# EAGLE schematic design4B (EAGLE 7.6.0)
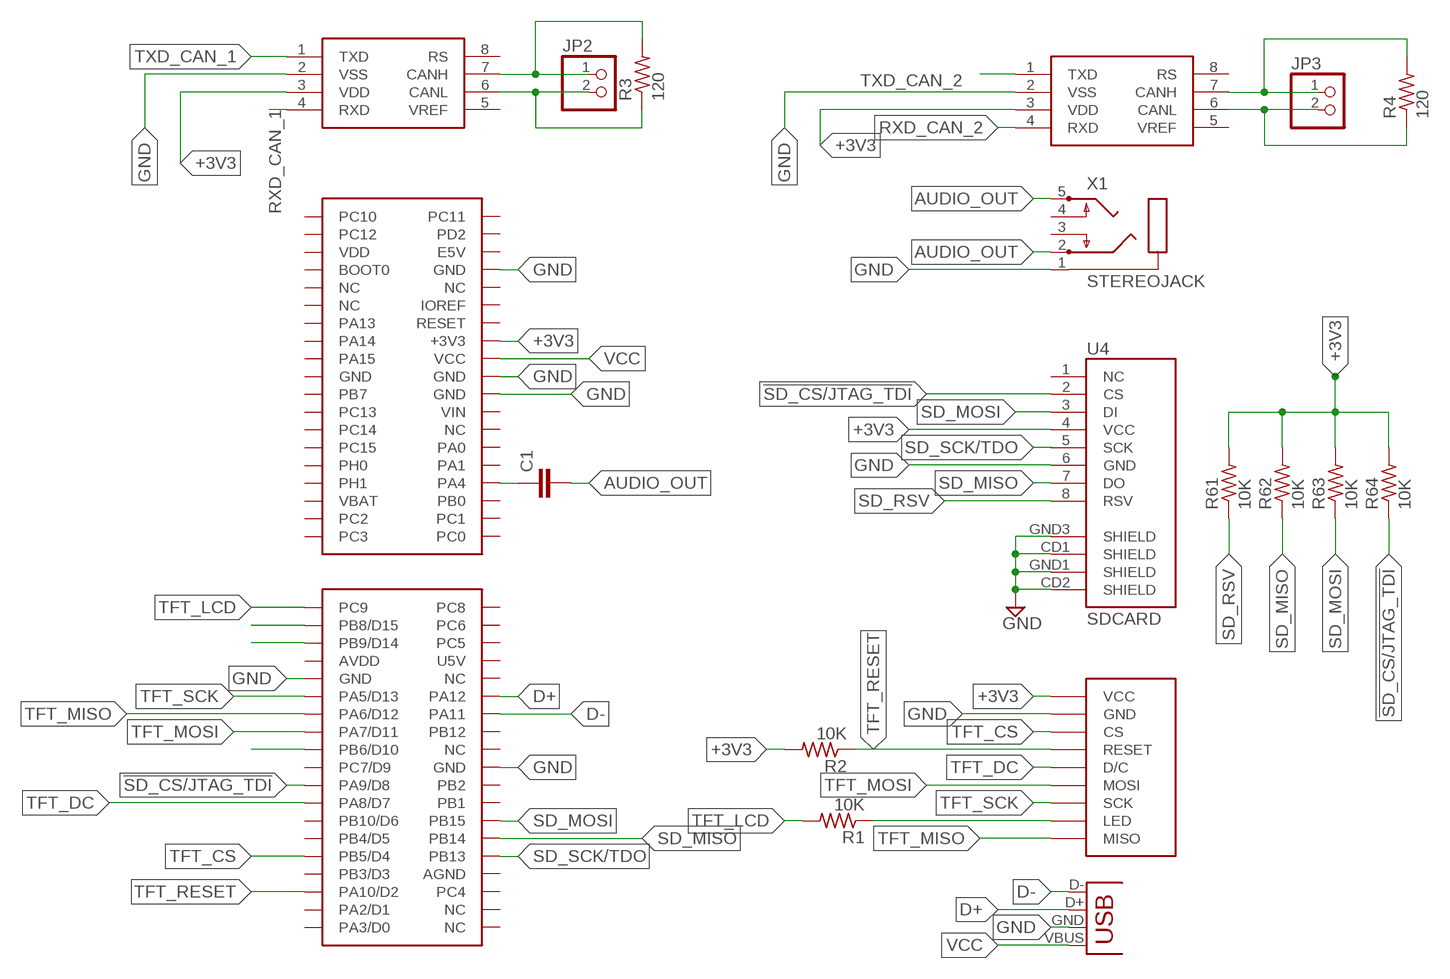
[diagram p0: schematic, sheet 1]

## Parts
C1  CAP1206  [1206]
J1  SPI_TFT_DISPLAY  [SPI_DISPLAY]
JP1  USB-A-H  [USB-A-H]
JP2  HEADER-1X2  [1X02_OVAL]
JP3  HEADER-1X2  [1X02_OVAL]
R1  10K  RESISTORRLC_0603  [RLC_0603@1]
R2  10K  RESISTORRLC_0603  [RLC_0603@1]
R3  120  RESISTORRLC_0603  [RLC_0603@1]
R4  120  RESISTORRLC_0603  [RLC_0603@1]
R61  10K  RESISTORRLC_0603  [RLC_0603@1]
R62  10K  RESISTORRLC_0603  [RLC_0603@1]
R63  10K  RESISTORRLC_0603  [RLC_0603@1]
R64  10K  RESISTORRLC_0603  [RLC_0603@1]
U1  MCP2551  [SO08]
U2  MCP2551  [SO08]
U4  SDCARD  USD-SOCKETNEW  [MICRO-SD-SOCKET-PP]
U$1  MOPHOMOPHO_466RE  [MOPHO]
X1  STEREOJACK  [STX3100]

## Nets
!SD_CS/JTAG_TDI: R64.1 U4.2(CS) U$1.P$59(PA9/D8)
+3V3: J1.VCC R2.2 R61.2 R62.2 R63.2 R64.2 U1.3(VDD) U2.3(VDD) U4.4(VCC) U$1.P$16(+3V3)
AUDIO_OUT: C1.2 X1.2 X1.5
D+: JP1.D+(D-) U$1.P$50(PA12)
D-: JP1.D-(D+) U$1.P$52(PA11)
GND: J1.GND JP1.GND(VBUS) U1.2(VSS) U2.2(VSS) U4.6(GND) U4.CD1(SHIELD) U4.CD2(SHIELD) U4.GND1(SHIELD) U4.GND3(SHIELD) U$1.P$8(GND) U$1.P$20(GND) U$1.P$22(GND) U$1.P$47(GND) U$1.P$58(GND) X1.1
N$1: C1.1 U$1.P$32(PA4)
N$2: JP2.1 R3.2 U2.7(CANH)
N$3: JP2.2 R3.1 U2.6(CANL)
N$4: JP3.1 R4.2 U1.7(CANH)
N$5: JP3.2 R4.1 U1.6(CANL)
N$6: U$1.P$43(PB9/D14)
N$7: U$1.P$41(PB8/D15)
N$8: J1.LED R1.1
N$9: U$1.P$55(PB6/D10)
RXD_CAN_1: U2.4(RXD)
RXD_CAN_2: U1.4(RXD)
SD_MISO: R62.1 U4.7(DO) U$1.P$66(PB14)
SD_MOSI: R63.1 U4.3(DI) U$1.P$64(PB15)
SD_RSV: R61.1 U4.8(RSV)
SD_SCK/TDO: U4.5(SCK) U$1.P$68(PB13)
TFT_CS: J1.CS U$1.P$67(PB5/D4)
TFT_DC: J1.D/C U$1.P$61(PA8/D7)
TFT_LCD: R1.2 U$1.P$39(PC9)
TFT_MISO: J1.MISO U$1.P$51(PA6/D12)
TFT_MOSI: J1.MOSI U$1.P$53(PA7/D11)
TFT_RESET: J1.RESET R2.1 U$1.P$71(PA10/D2)
TFT_SCK: J1.SCK U$1.P$49(PA5/D13)
TXD_CAN_1: U2.1(TXD)
TXD_CAN_2: U1.1(TXD)
VCC: JP1.VBUS(GND) U$1.P$18(VCC)
Unconnected: U1.5(VREF) U1.8(RS) U2.5(VREF) U2.8(RS) U4.1(NC) U$1.P$1(PC10) U$1.P$2(PC11) U$1.P$3(PC12) U$1.P$4(PD2) U$1.P$6(E5V) U$1.P$7(BOOT0) U$1.P$9(NC) U$1.P$10(NC) U$1.P$11(NC) U$1.P$12(IOREF) U$1.P$13(PA13) U$1.P$14(RESET) U$1.P$15(PA14) U$1.P$17(PA15) U$1.P$19(GND) U$1.P$21(PB7) U$1.P$23(PC13) U$1.P$25(PC14) U$1.P$26(NC) U$1.P$27(PC15) U$1.P$28(PA0) U$1.P$29(PH0) U$1.P$30(PA1) U$1.P$31(PH1) U$1.P$34(PB0) U$1.P$35(PC2) U$1.P$36(PC1) U$1.P$37(PC3) U$1.P$38(PC0) U$1.P$40(PC8) U$1.P$42(PC6) U$1.P$44(PC5) U$1.P$46(U5V) U$1.P$48(NC) U$1.P$54(PB12) U$1.P$56(NC) U$1.P$57(PC7/D9) U$1.P$60(PB2) U$1.P$62(PB1) U$1.P$63(PB10/D6) U$1.P$65(PB4/D5) U$1.P$69(PB3/D3) U$1.P$70(AGND) U$1.P$72(PC4) U$1.P$73(PA2/D1) U$1.P$74(NC) U$1.P$75(PA3/D0) U$1.P$76(NC) X1.3 X1.4

## Power pins joined to a net without a drawn wire
AVDD: U$1.P$45(AVDD)
VBAT: U$1.P$33(VBAT)
VDD: U$1.P$5(VDD)
VIN: U$1.P$24(VIN)

## Library data of the parts
C1 = SparkFun:CAP: Capacitor Standard 0603 ceramic capacitor, and 0.1" leaded capacitor.
J1 = kanflo:SPI_TFT_DISPLAY: SPI TFT Display Connector for the cheap 2.2"/2.4" Serial SPI TFT displays found on eBay.
JP1 = SparkFun-Connectors:USB: USB Connectors USB-B-PTH is fully proven SKU : PRT-00139/CONN-08278 USB-miniB is fully proven SKU : PRT-00587 USB-A-PCB is untested. USB-A-H is throughly reviewed, but untested. Spark Fun Electronics SKU : PRT-00437 USB-B-SMT is throughly reviewed, but untested. Needs silkscreen touching up. USB-A-S has not been used/tested USB-MB-H has not been used/tested USB-MICROB has been used. CONN-09505
JP2 JP3 = microbuilder:HEADER-1X2: PIN HEADER
R1-R4 R61-R64 = STM32-PROX:RESISTOR; DIGIKEY: RMCF0603JT10K0CT-ND; MPN: RMCF0603JT10K0; OC_NEWARK: unknown; PARTNO: RMCF0603JT10K0
U1 U2 = SparkFun:MCP2551
U4 = STM32-PROX:USD-SOCKET: microSD Socket Push-push type uSD socket. Schematic element and footprint production proven. Spark Fun Electronics SKU : PRT-00127. tDoc lines correctly indicate media card edge positions when inserting (unlocked, locked, depressed).; OC_NEWARK: unknown; PARTNO: *
U$1 = mopho:MOPHO
X1 = adafruit:STEREOJACK: MIC/HEADPHONE JACK Stereo jack with two switches. Kycon STX3100, CUI SJ1-3555NG and/or 4UCon 05544

## Net classes
0 default: width 0.203 mm
2 power: width 0.279 mm, drill 0.254 mm